# EAGLE design HP35_Z80 (EAGLE 7.6.0)

## Sheet 1 of 2
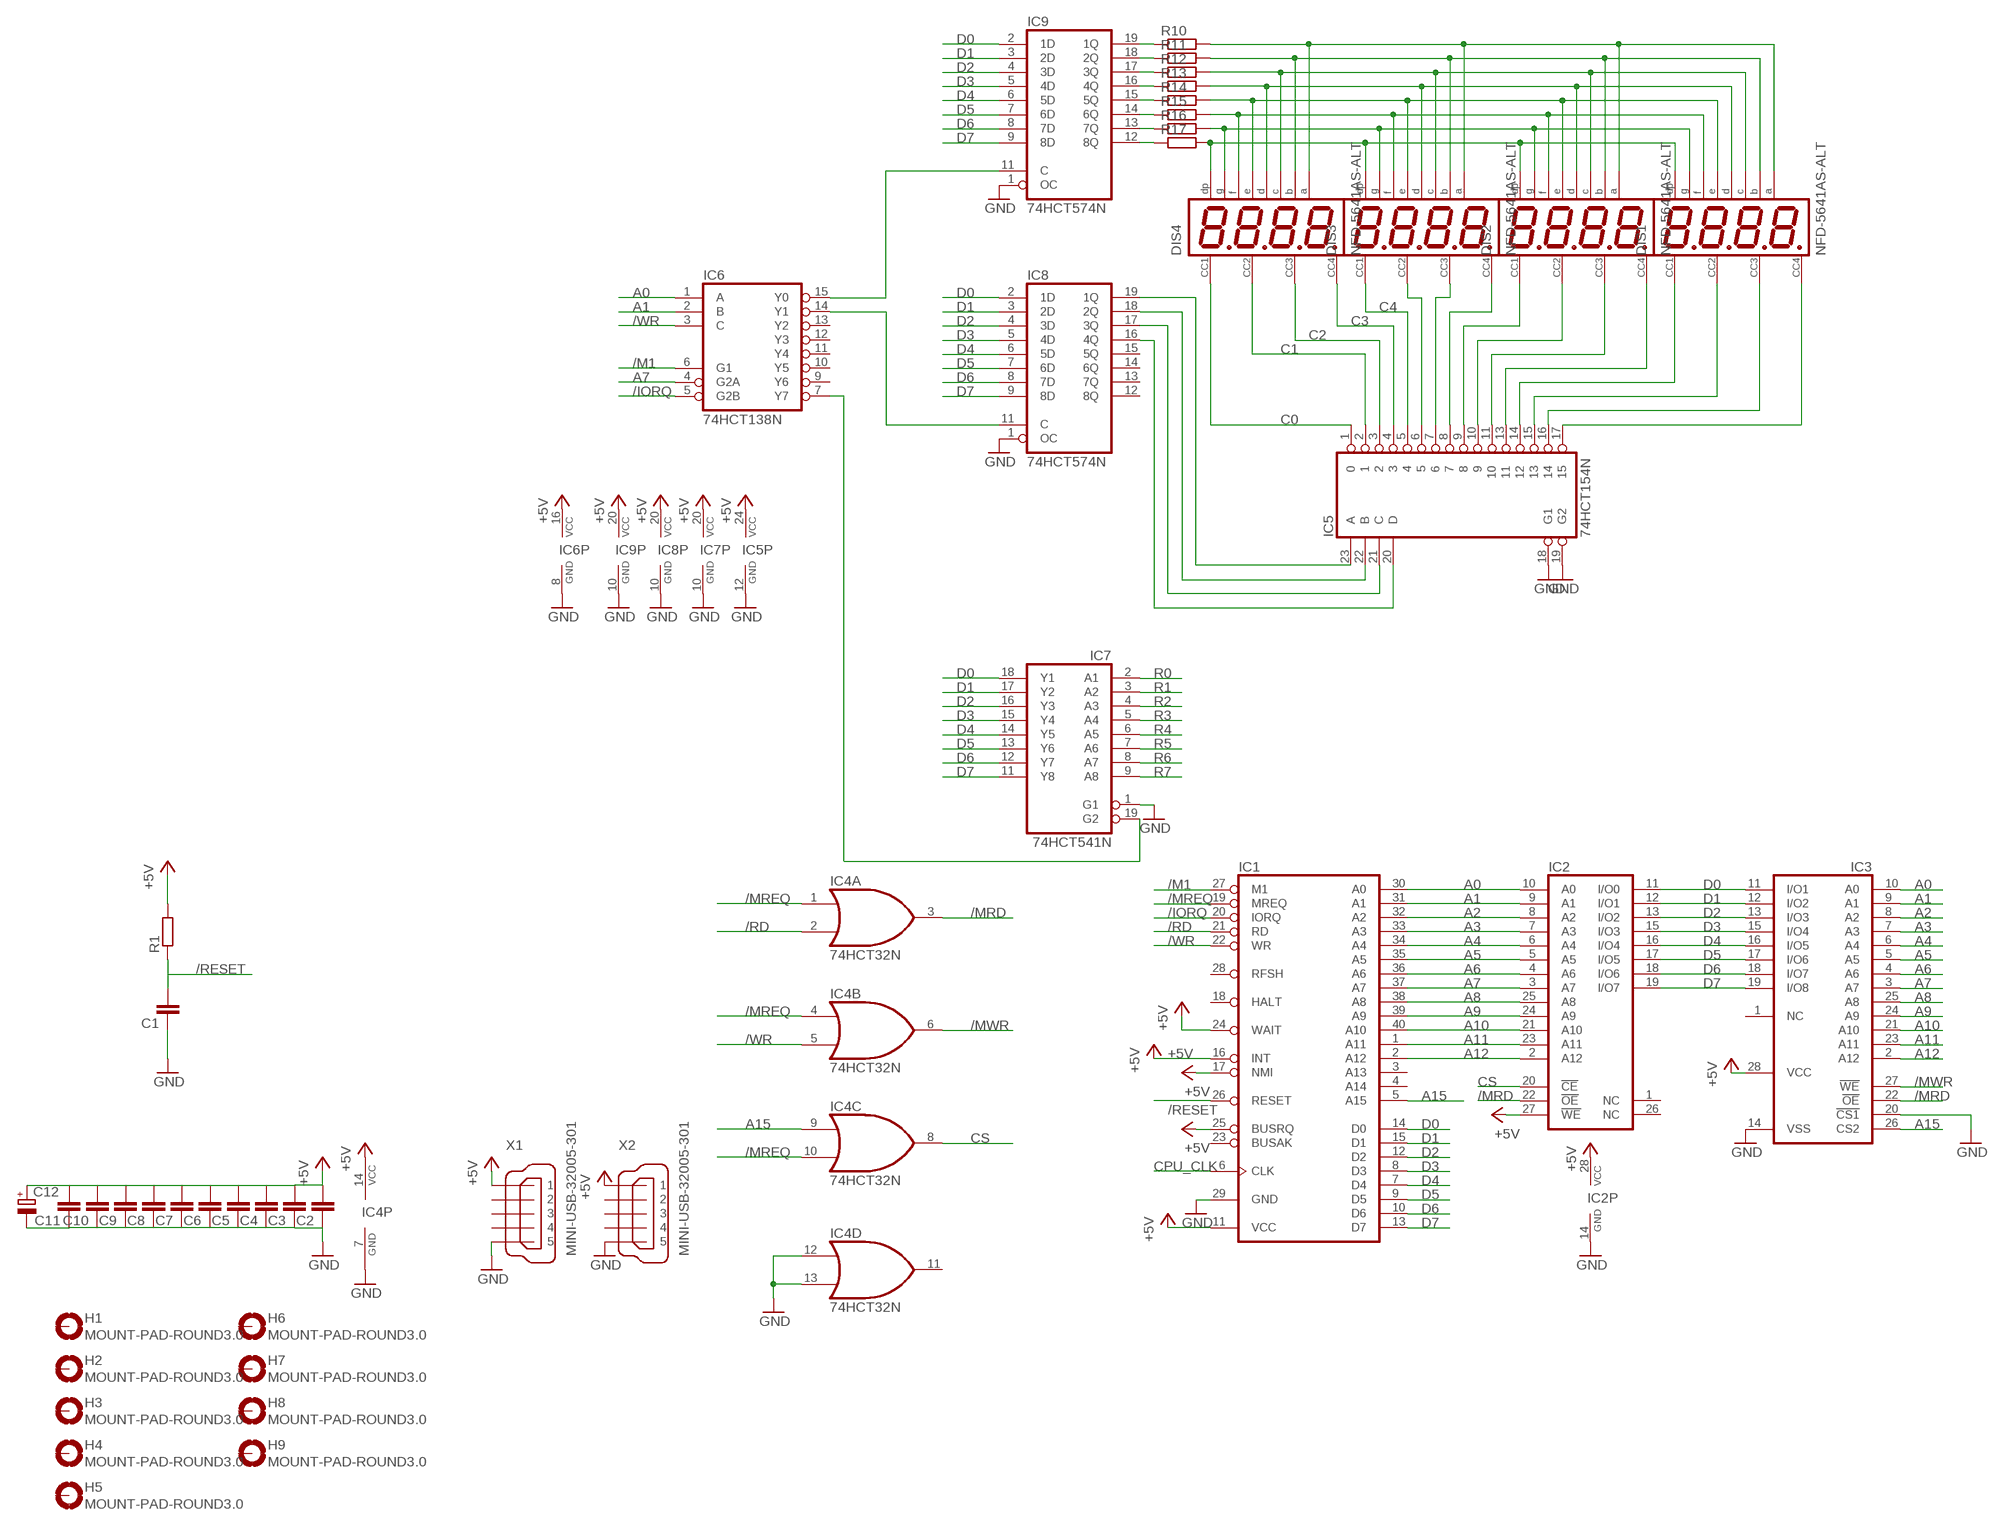
[diagram p0: schematic, sheet 1, part 1 of 2]
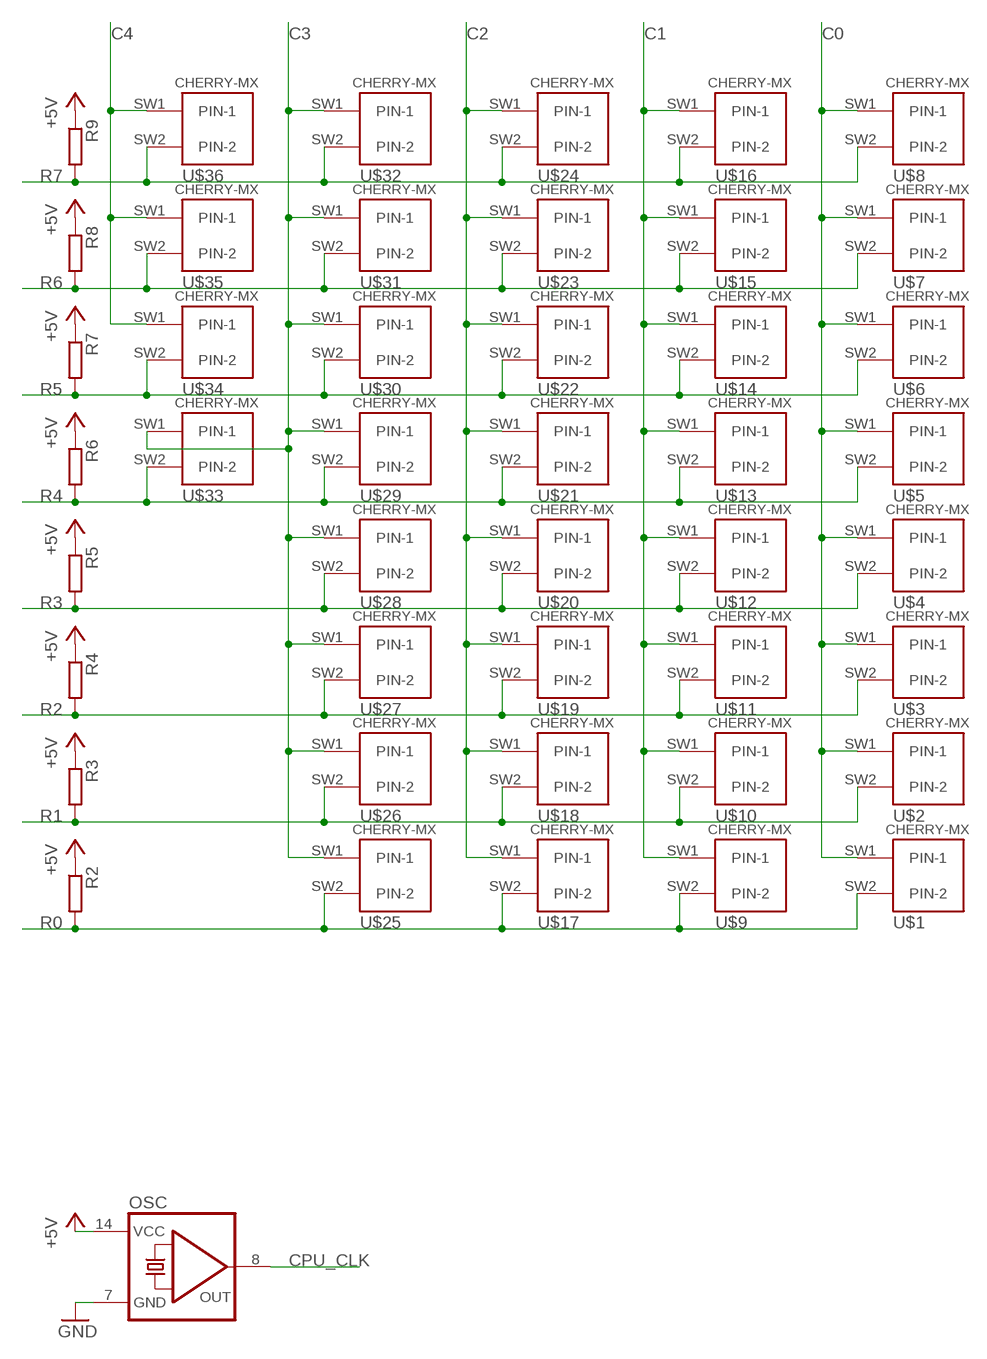
[diagram p1: schematic, sheet 1, part 2 of 2]

### Parts
C1  C-EUC1206  [C1206]
C2  C-EUC1206  [C1206]
C3  C-EUC1206  [C1206]
C4  C-EUC1206  [C1206]
C5  C-EUC1206  [C1206]
C6  C-EUC1206  [C1206]
C7  C-EUC1206  [C1206]
C8  C-EUC1206  [C1206]
C9  C-EUC1206  [C1206]
C10  C-EUC1206  [C1206]
C11  C-EUC1206  [C1206]
C12  CPOL-EUSMCD  [SMC_D]
DIS1  NFD-5641AS-ALT  [NFD-5641]
DIS2  NFD-5641AS-ALT  [NFD-5641]
DIS3  NFD-5641AS-ALT  [NFD-5641]
DIS4  NFD-5641AS-ALT  [NFD-5641]
H1  MOUNT-PAD-ROUND3.0  [3,0-PAD]
H2  MOUNT-PAD-ROUND3.0  [3,0-PAD]
H3  MOUNT-PAD-ROUND3.0  [3,0-PAD]
H4  MOUNT-PAD-ROUND3.0  [3,0-PAD]
H5  MOUNT-PAD-ROUND3.0  [3,0-PAD]
H6  MOUNT-PAD-ROUND3.0  [3,0-PAD]
H7  MOUNT-PAD-ROUND3.0  [3,0-PAD]
H8  MOUNT-PAD-ROUND3.0  [3,0-PAD]
H9  MOUNT-PAD-ROUND3.0  [3,0-PAD]
IC1  Z80CPU  [DIL40]
IC2  78C64P  [DIL28-6]
IC3  6264A  [DIL28-6]
IC4  74HCT32N  7432N  [DIL14]
IC5  74HCT154N  [DIL24-6]
IC6  74HCT138N  [DIL16]
IC7  74HCT541N  [DIL20]
IC8  74HCT574N  74HCT573N  [DIL20]
IC9  74HCT574N  74HCT573N  [DIL20]
OSC  QG5860  [DIL14S]
R1  R-EU_R1206  [R1206]
R2  R-EU_R1206  [R1206]
R3  R-EU_R1206  [R1206]
R4  R-EU_R1206  [R1206]
R5  R-EU_R1206  [R1206]
R6  R-EU_R1206  [R1206]
R7  R-EU_R1206  [R1206]
R8  R-EU_R1206  [R1206]
R9  R-EU_R1206  [R1206]
R10  R-EU_R1206  [R1206]
R11  R-EU_R1206  [R1206]
R12  R-EU_R1206  [R1206]
R13  R-EU_R1206  [R1206]
R14  R-EU_R1206  [R1206]
R15  R-EU_R1206  [R1206]
R16  R-EU_R1206  [R1206]
R17  R-EU_R1206  [R1206]
U$1  CHERRY-MX  [CHERRY-MX]
U$2  CHERRY-MX  [CHERRY-MX]
U$3  CHERRY-MX  [CHERRY-MX]
U$4  CHERRY-MX  [CHERRY-MX]
U$5  CHERRY-MX  [CHERRY-MX]
U$6  CHERRY-MX  [CHERRY-MX]
U$7  CHERRY-MX  [CHERRY-MX]
U$8  CHERRY-MX  [CHERRY-MX]
U$9  CHERRY-MX  [CHERRY-MX]
U$10  CHERRY-MX  [CHERRY-MX]
U$11  CHERRY-MX  [CHERRY-MX]
U$12  CHERRY-MX  [CHERRY-MX]
U$13  CHERRY-MX  [CHERRY-MX]
U$14  CHERRY-MX  [CHERRY-MX]
U$15  CHERRY-MX  [CHERRY-MX]
U$16  CHERRY-MX  [CHERRY-MX]
U$17  CHERRY-MX  [CHERRY-MX]
U$18  CHERRY-MX  [CHERRY-MX]
U$19  CHERRY-MX  [CHERRY-MX]
U$20  CHERRY-MX  [CHERRY-MX]
U$21  CHERRY-MX  [CHERRY-MX]
U$22  CHERRY-MX  [CHERRY-MX]
U$23  CHERRY-MX  [CHERRY-MX]
U$24  CHERRY-MX  [CHERRY-MX]
U$25  CHERRY-MX  [CHERRY-MX]
U$26  CHERRY-MX  [CHERRY-MX]
U$27  CHERRY-MX  [CHERRY-MX]
U$28  CHERRY-MX  [CHERRY-MX]
U$29  CHERRY-MX  [CHERRY-MX]
U$30  CHERRY-MX  [CHERRY-MX]
U$31  CHERRY-MX  [CHERRY-MX]
U$32  CHERRY-MX  [CHERRY-MX]
U$33  CHERRY-MX  [CHERRY-MX]
U$34  CHERRY-MX  [CHERRY-MX]
U$35  CHERRY-MX  [CHERRY-MX]
U$36  CHERRY-MX  [CHERRY-MX]
X1  MINI-USB-32005-301  [32005-301]
X2  MINI-USB-32005-301  [32005-301]

### Nets
+5V: C2.2 C3.2 C4.2 C5.2 C6.2 C7.2 C8.2 C9.2 C10.2 C11.2 C12.+ IC1.11(VCC) IC1.16(INT) IC1.17(NMI) IC1.24(WAIT) IC1.25(BUSRQ) IC2.27(!WE) IC2.28(VCC) IC3.28(VCC) IC4.14(P:VCC) IC5.24(VCC) IC6.16(VCC) IC7.20(VCC) IC8.20(VCC) IC9.20(VCC) OSC.14(VCC) R1.2 R2.1 R3.1 R4.1 R5.1 R6.1 R7.1 R8.1 R9.1 X1.1 X2.1
/IORQ: IC1.20(IORQ) IC6.5(G2B)
/M1: IC1.27(M1) IC6.6(G1)
/MRD: IC2.22(!OE) IC3.22(!OE) IC4.3(A:O)
/MREQ: IC1.19(MREQ) IC4.1(A:I0) IC4.4(B:I0) IC4.10(C:I1)
/MWR: IC3.27(!WE) IC4.6(B:O)
/RD: IC1.21(RD) IC4.2(A:I1)
/RESET: C1.2 IC1.26(RESET) R1.1
/WR: IC1.22(WR) IC4.5(B:I1) IC6.3(C)
A0: IC1.30(A0) IC2.10(A0) IC3.10(A0) IC6.1(A)
A1: IC1.31(A1) IC2.9(A1) IC3.9(A1) IC6.2(B)
A2: IC1.32(A2) IC2.8(A2) IC3.8(A2)
A3: IC1.33(A3) IC2.7(A3) IC3.7(A3)
A4: IC1.34(A4) IC2.6(A4) IC3.6(A4)
A5: IC1.35(A5) IC2.5(A5) IC3.5(A5)
A6: IC1.36(A6) IC2.4(A6) IC3.4(A6)
A7: IC1.37(A7) IC2.3(A7) IC3.3(A7) IC6.4(G2A)
A8: IC1.38(A8) IC2.25(A8) IC3.25(A8)
A9: IC1.39(A9) IC2.24(A9) IC3.24(A9)
A10: IC1.40(A10) IC2.21(A10) IC3.21(A10)
A11: IC1.1(A11) IC2.23(A11) IC3.23(A11)
A12: IC1.2(A12) IC2.2(A12) IC3.2(A12)
A15: IC1.5(A15) IC3.26(CS2) IC4.9(C:I0)
C0: DIS4.P$12 IC5.1 U$1.SW1(PIN-1) U$2.SW1(PIN-1) U$3.SW1(PIN-1) U$4.SW1(PIN-1) U$5.SW1(PIN-1) U$6.SW1(PIN-1) U$7.SW1(PIN-1) U$8.SW1(PIN-1)
C1: DIS4.P$9 IC5.2 U$9.SW1(PIN-1) U$10.SW1(PIN-1) U$11.SW1(PIN-1) U$12.SW1(PIN-1) U$13.SW1(PIN-1) U$14.SW1(PIN-1) U$15.SW1(PIN-1) U$16.SW1(PIN-1)
C2: DIS4.P$8 IC5.3 U$17.SW1(PIN-1) U$18.SW1(PIN-1) U$19.SW1(PIN-1) U$20.SW1(PIN-1) U$21.SW1(PIN-1) U$22.SW1(PIN-1) U$23.SW1(PIN-1) U$24.SW1(PIN-1)
C3: DIS4.P$6 IC5.4 U$25.SW1(PIN-1) U$26.SW1(PIN-1) U$27.SW1(PIN-1) U$28.SW1(PIN-1) U$29.SW1(PIN-1) U$30.SW1(PIN-1) U$31.SW1(PIN-1) U$32.SW1(PIN-1) U$33.SW1(PIN-1)
C4: DIS3.P$12 IC5.5 U$34.SW1(PIN-1) U$35.SW1(PIN-1) U$36.SW1(PIN-1)
CPU_CLK: IC1.6(CLK) OSC.8(OUT)
CS: IC2.20(!CE) IC4.8(C:O)
D0: IC1.14(D0) IC2.11(I/O0) IC3.11(I/O1) IC7.18(Y1) IC8.2(1D) IC9.2(1D)
D1: IC1.15(D1) IC2.12(I/O1) IC3.12(I/O2) IC7.17(Y2) IC8.3(2D) IC9.3(2D)
D2: IC1.12(D2) IC2.13(I/O2) IC3.13(I/O3) IC7.16(Y3) IC8.4(3D) IC9.4(3D)
D3: IC1.8(D3) IC2.15(I/O3) IC3.15(I/O4) IC7.15(Y4) IC8.5(4D) IC9.5(4D)
D4: IC1.7(D4) IC2.16(I/O4) IC3.16(I/O5) IC7.14(Y5) IC8.6(5D) IC9.6(5D)
D5: IC1.9(D5) IC2.17(I/O5) IC3.17(I/O6) IC7.13(Y6) IC8.7(6D) IC9.7(6D)
D6: IC1.10(D6) IC2.18(I/O6) IC3.18(I/O7) IC7.12(Y7) IC8.8(7D) IC9.8(7D)
D7: IC1.13(D7) IC2.19(I/O7) IC3.19(I/O8) IC7.11(Y8) IC8.9(8D) IC9.9(8D)
GND: C1.1 C2.1 C3.1 C4.1 C5.1 C6.1 C7.1 C8.1 C9.1 C10.1 C11.1 C12.- IC1.29(GND) IC2.14(GND) IC3.14(VSS) IC3.20(!CS1) IC4.7(P:GND) IC4.12(D:I0) IC4.13(D:I1) IC5.12(GND) IC5.18(G1) IC5.19(G2) IC6.8(GND) IC7.1(G1) IC7.10(GND) IC8.1(OC) IC8.10(GND) IC9.1(OC) IC9.10(GND) OSC.7(GND) X1.5 X2.5
N$1: IC6.15(Y0) IC9.11(C)
N$2: IC5.20(D) IC8.16(4Q)
N$3: IC6.14(Y1) IC8.11(C)
N$4: IC5.21(C) IC8.17(3Q)
N$5: IC5.22(B) IC8.18(2Q)
N$6: IC5.23(A) IC8.19(1Q)
N$8: IC6.7(Y7) IC7.19(G2)
N$9: IC9.12(8Q) R17.1
N$10: IC9.13(7Q) R16.1
N$11: IC9.14(6Q) R15.1
N$12: IC9.15(5Q) R14.1
N$13: DIS3.P$9 IC5.6
N$14: DIS3.P$8 IC5.7
N$15: DIS3.P$6 IC5.8
N$16: DIS2.P$12 IC5.9
N$17: DIS2.P$9 IC5.10
N$18: DIS2.P$8 IC5.11
N$19: DIS2.P$6 IC5.13
N$20: DIS1.P$12 IC5.14
N$21: DIS1.P$9 IC5.15
N$22: DIS1.P$8 IC5.16
N$23: DIS1.P$6 IC5.17
N$24: IC9.16(4Q) R13.1
N$25: IC9.17(3Q) R12.1
N$26: IC9.18(2Q) R11.1
N$27: IC9.19(1Q) R10.1
N$28: DIS1.P$11 DIS2.P$11 DIS3.P$11 DIS4.P$11 R10.2
N$31: DIS1.P$3 DIS2.P$3 DIS3.P$3 DIS4.P$3 R17.2
N$32: DIS1.P$5 DIS2.P$5 DIS3.P$5 DIS4.P$5 R16.2
N$33: DIS1.P$10 DIS2.P$10 DIS3.P$10 DIS4.P$10 R15.2
N$34: DIS1.P$1 DIS2.P$1 DIS3.P$1 DIS4.P$1 R14.2
N$36: DIS1.P$7 DIS2.P$7 DIS3.P$7 DIS4.P$7 R11.2
N$37: DIS1.P$4 DIS2.P$4 DIS3.P$4 DIS4.P$4 R12.2
N$38: DIS1.P$2 DIS2.P$2 DIS3.P$2 DIS4.P$2 R13.2
R0: IC7.2(A1) R2.2 U$1.SW2(PIN-2) U$9.SW2(PIN-2) U$17.SW2(PIN-2) U$25.SW2(PIN-2)
R1: IC7.3(A2) R3.2 U$2.SW2(PIN-2) U$10.SW2(PIN-2) U$18.SW2(PIN-2) U$26.SW2(PIN-2)
R2: IC7.4(A3) R4.2 U$3.SW2(PIN-2) U$11.SW2(PIN-2) U$19.SW2(PIN-2) U$27.SW2(PIN-2)
R3: IC7.5(A4) R5.2 U$4.SW2(PIN-2) U$12.SW2(PIN-2) U$20.SW2(PIN-2) U$28.SW2(PIN-2)
R4: IC7.6(A5) R6.2 U$5.SW2(PIN-2) U$13.SW2(PIN-2) U$21.SW2(PIN-2) U$29.SW2(PIN-2) U$33.SW2(PIN-2)
R5: IC7.7(A6) R7.2 U$6.SW2(PIN-2) U$14.SW2(PIN-2) U$22.SW2(PIN-2) U$30.SW2(PIN-2) U$34.SW2(PIN-2)
R6: IC7.8(A7) R8.2 U$7.SW2(PIN-2) U$15.SW2(PIN-2) U$23.SW2(PIN-2) U$31.SW2(PIN-2) U$35.SW2(PIN-2)
R7: IC7.9(A8) R9.2 U$8.SW2(PIN-2) U$16.SW2(PIN-2) U$24.SW2(PIN-2) U$32.SW2(PIN-2) U$36.SW2(PIN-2)
Unconnected: H1.B3,0(MOUNT) H2.B3,0(MOUNT) H3.B3,0(MOUNT) H4.B3,0(MOUNT) H5.B3,0(MOUNT) H6.B3,0(MOUNT) H7.B3,0(MOUNT) H8.B3,0(MOUNT) H9.B3,0(MOUNT) IC1.3(A13) IC1.4(A14) IC1.18(HALT) IC1.23(BUSAK) IC1.28(RFSH) IC2.1(NC) IC2.26(NC) IC3.1(NC) IC4.11(D:O) IC6.9(Y6) IC6.10(Y5) IC6.11(Y4) IC6.12(Y3) IC6.13(Y2) IC8.12(8Q) IC8.13(7Q) IC8.14(6Q) IC8.15(5Q) X1.2 X1.3 X1.4 X2.2 X2.3 X2.4

## Sheet 2 of 2

## Library data of the parts
C1-C11 = rcl:C-EU: CAPACITOR, European symbol
C12 = rcl:CPOL-EU: POLARIZED CAPACITOR, European symbol
DIS1-DIS4 = display-nfd:NFD-5641AS-ALT: Four Digit 0.56" CC Seven-Segment LED Display Futurlec part number: 7FR5641AS Created by RobG
H1-H9 = holes:MOUNT-PAD-ROUND: MOUNTING PAD, round
IC1 = zilog:Z80CPU: Z80 FAMILY DEVICE
IC2 = memory-idt:78C64P: MEMORY; OC_FARNELL: unknown; OC_NEWARK: unknown
IC3 = memory-hitachi:6264A: MEMORY; OC_FARNELL: 283605; OC_NEWARK: unknown
IC4 = 74xx-us:74*32: Quad 2-input OR gate
IC5 = 74xx-eu:74*154: 4-line to 16-line data SELECTOR/MULTIPLEXER
IC6 = 74xx-eu:74*138: 3-line to 8-line DECODER/DEMULTIPLEXER
IC7 = 74xx-eu:74*541: Octal BUFFER and LINE DRIVER, 3-state
IC8 IC9 = 74xx-eu:74*573: 8-bit D latch BUS DRIVER
OSC = crystal:QG5860: CRYSTAL RESONATOR; OC_FARNELL: unknown; OC_NEWARK: unknown
R1-R17 = rcl:R-EU_: RESISTOR, European symbol
U$1-U$36 = cherry:CHERRY-MX: Cherry MX series keyswitch
X1 X2 = con-cypressindustries:MINI-USB-: MINI USB-B Conector Source: www.cypressindustries.com; OC_FARNELL: unknown; OC_NEWARK: unknown

## Board
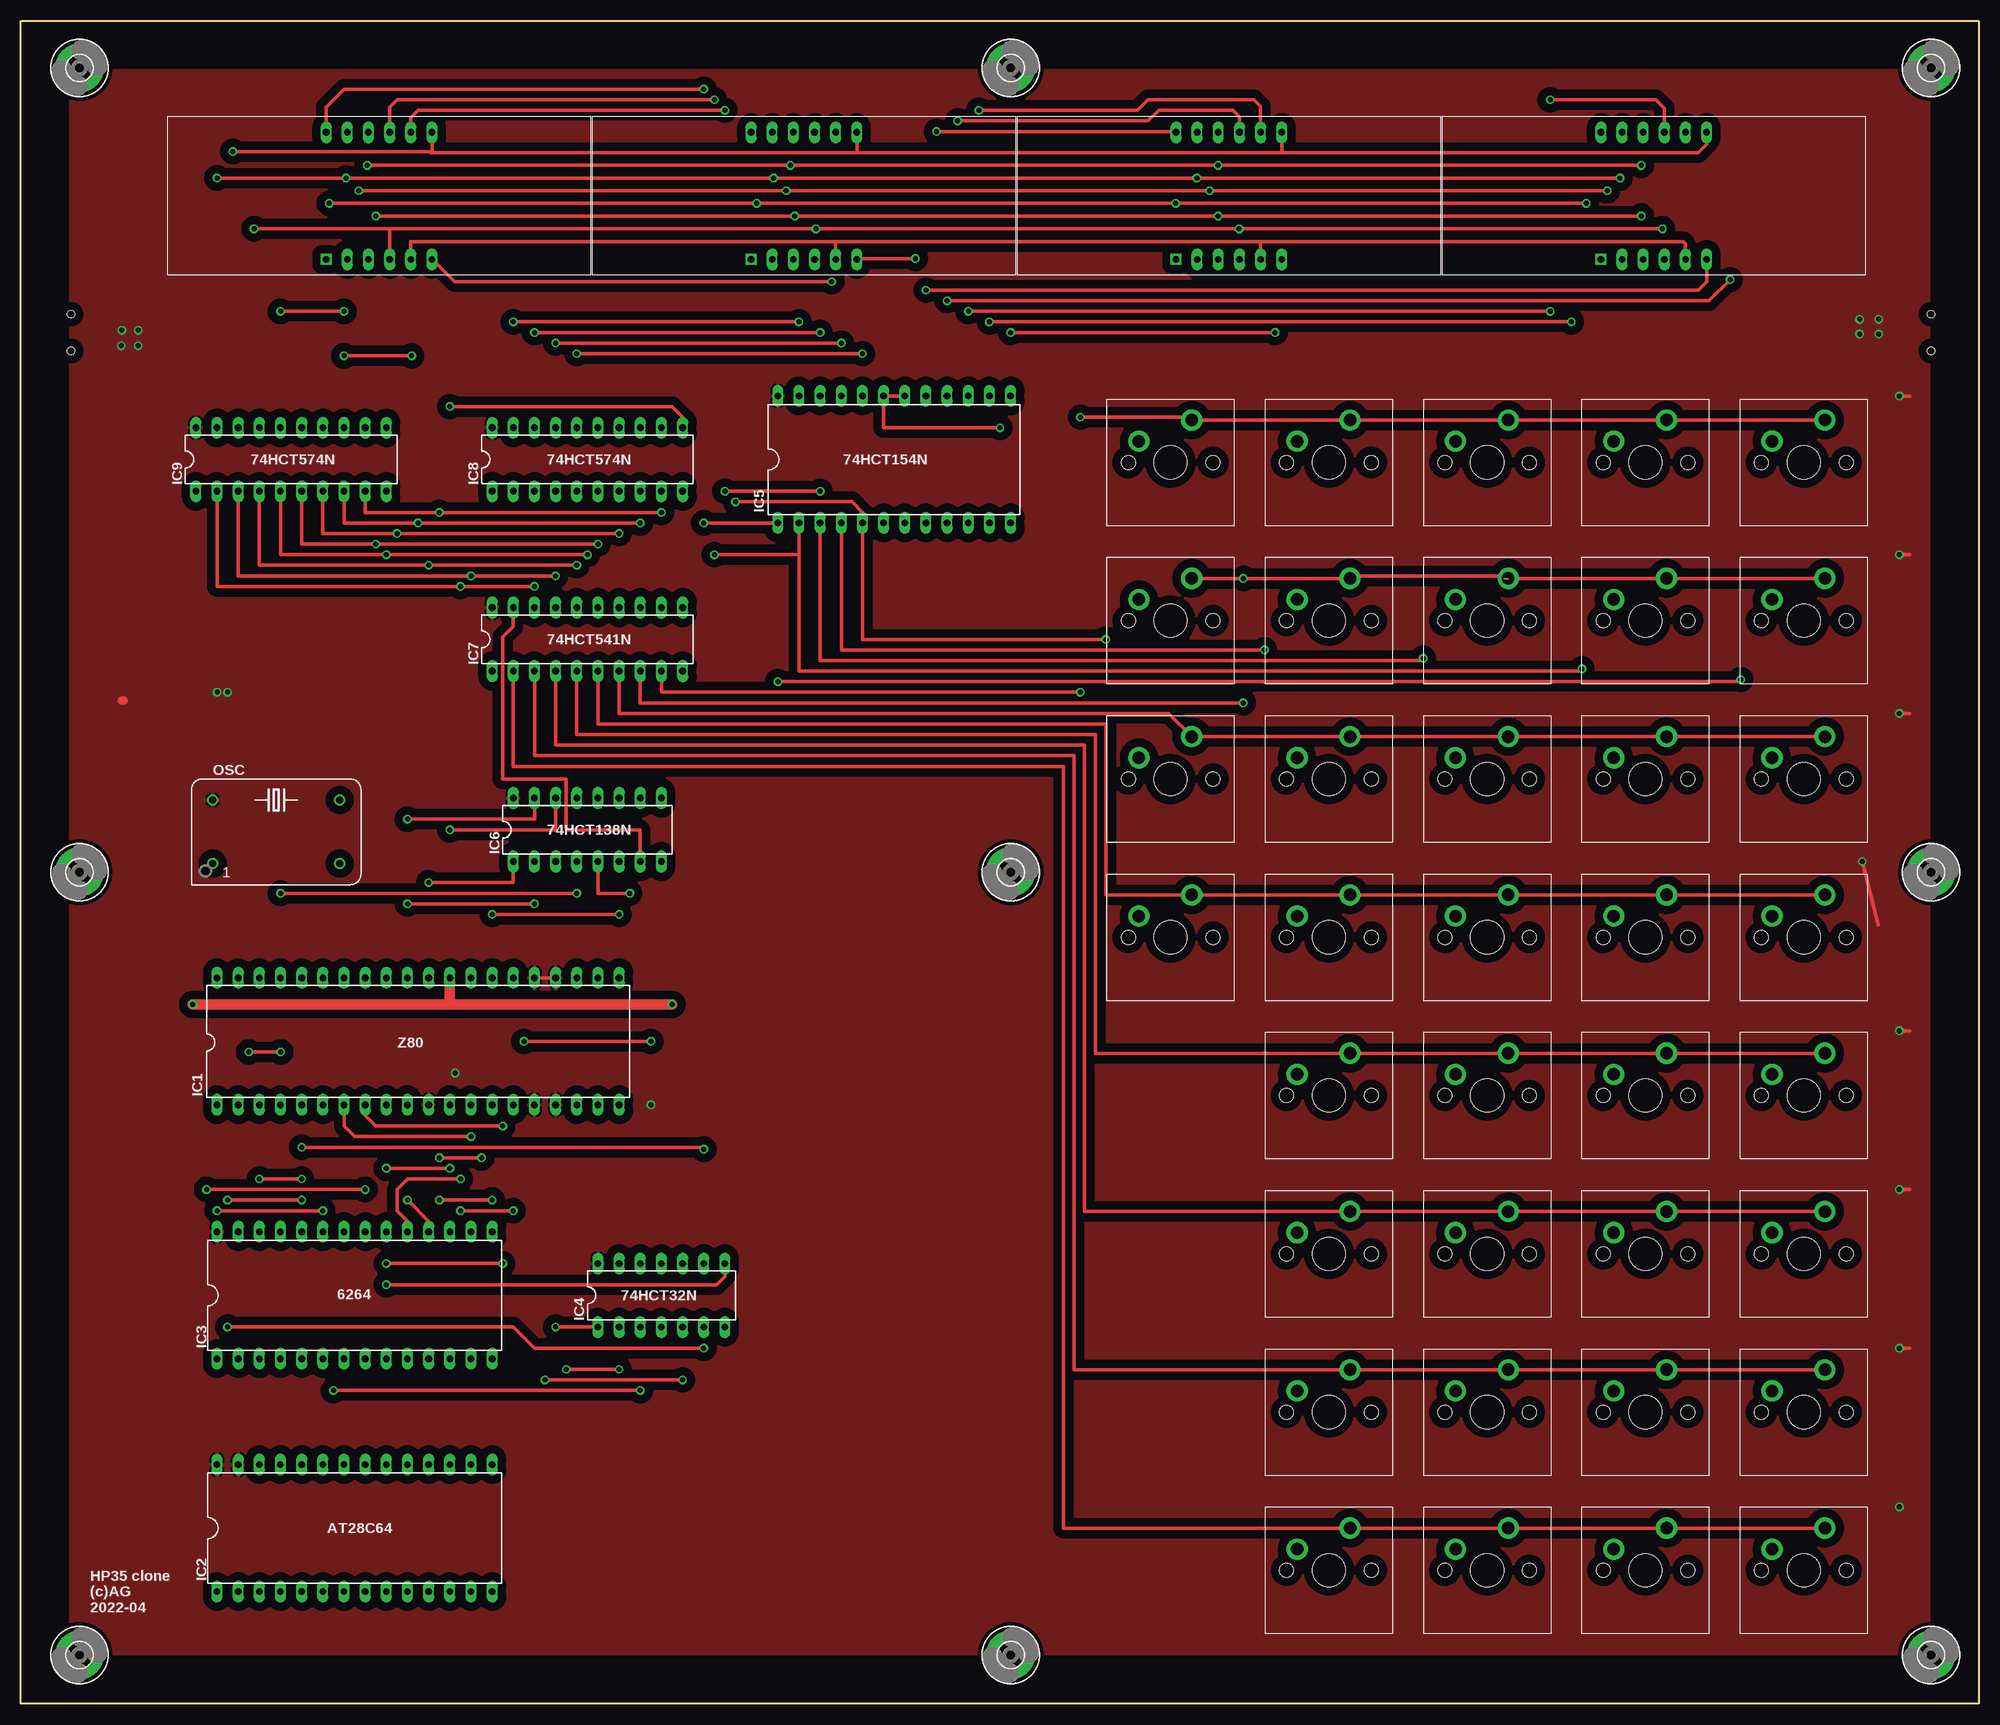
[diagram p2: board, top side]
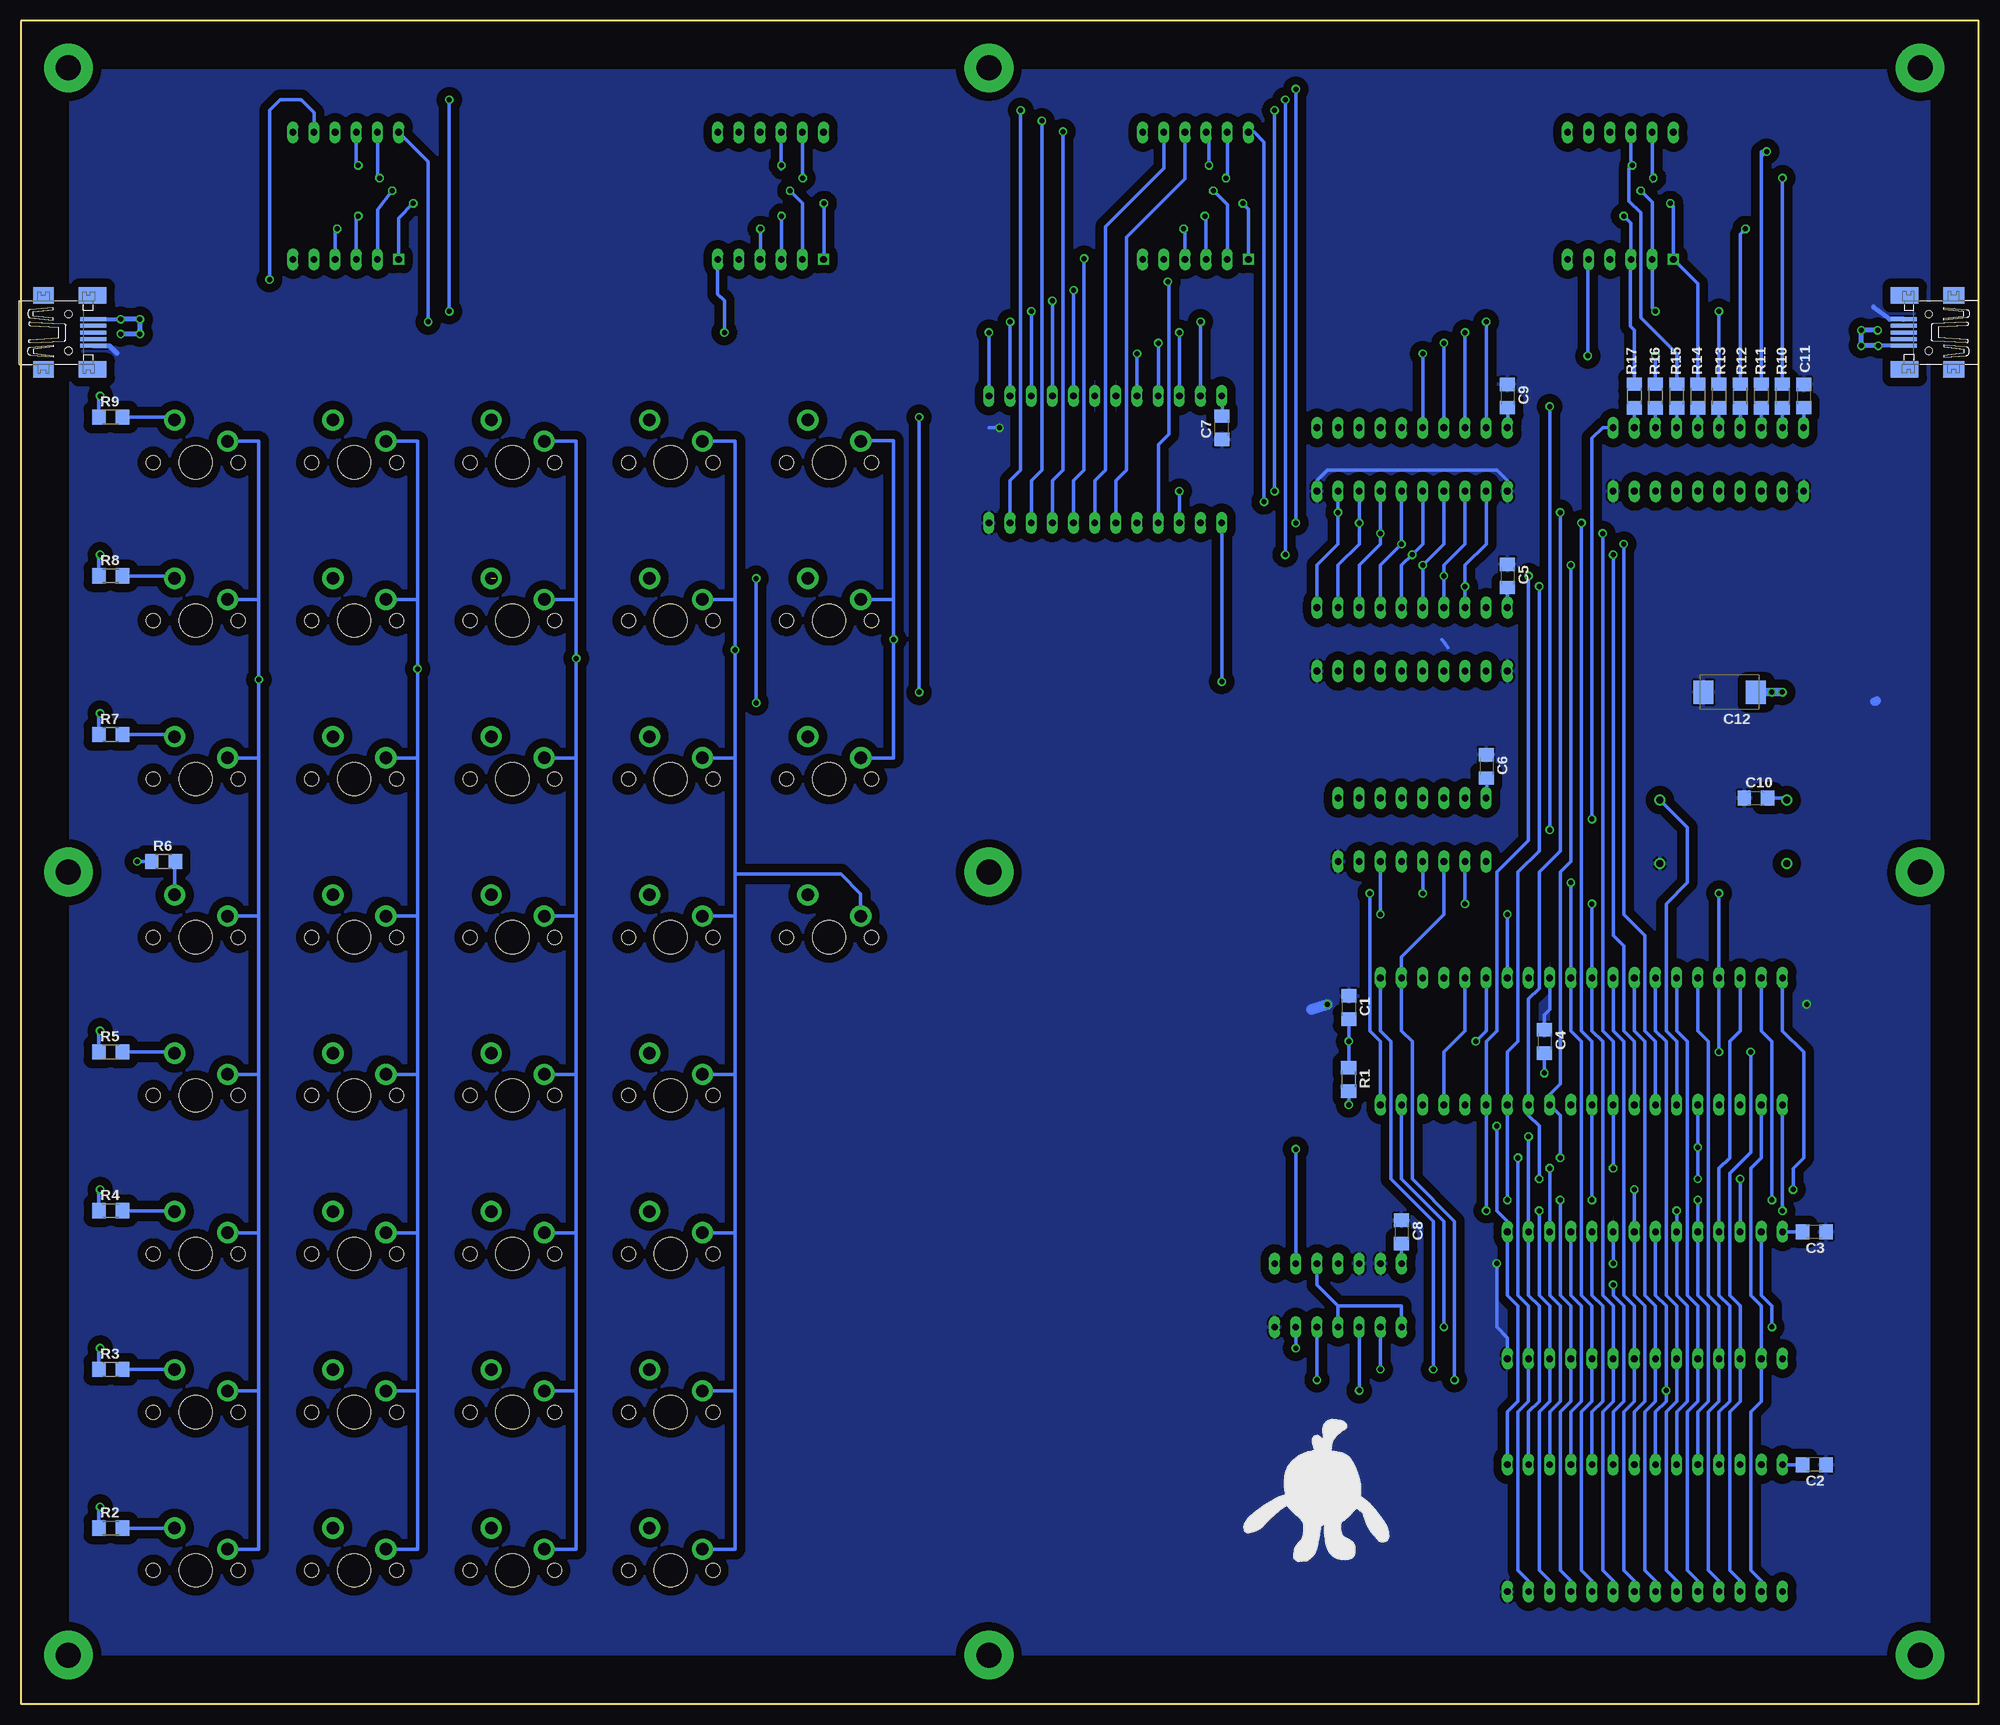
[diagram p3: board, bottom side, seen from below]

Size 235 x 202 mm. Coordinates in mm from the lower left corner, seen from the top.
Outline: 0,0 0,202 235,202 235,0 0,0
Copper layers (1*16): Top 0.035mm / dielectric 1.5mm / Bottom 0.035mm
Design rules "default *": minimum track width 10mil, minimum drill 10mil, track to track 8mil, track to pad 8mil, pad to pad 8mil, via to via 8mil, smd to smd 8mil, copper to edge 40mil, drill to drill 8mil, minimum pad ring 10mil, minimum via ring 8mil, stop-mask expansion 4mil, vias tented up to drill 50mil, thermal gap 10mil

### Footprints (pad centres in the part's own frame; a part is rotated, then mirrored left to right if it is on the bottom)
C1206 = smd 1.6 x 1.8: 1 -1.4,0; 2 1.4,0
SMC_D = smd 2.4 x 2.8: + -3.15,0; - 3.15,0
NFD-5641 = drill 0.8 square: P$1 -6.35,-7.62 | drill 0.8 long: P$2 -3.81,-7.62; P$3 -1.27,-7.62; P$4 1.27,-7.62; P$5 3.81,-7.62; P$6 6.35,-7.62; P$7 6.35,7.62; P$8 3.81,7.62; P$9 1.27,7.62; P$10 -1.27,7.62; P$11 -3.81,7.62; P$12 -6.35,7.62
3,0-PAD = drill 3 pad 5.842: B3,0 0,0
DIL40 = drill 0.813 long: 1 -24.13,-7.62; 2 -21.59,-7.62; 3 -19.05,-7.62; 4 -16.51,-7.62; 5 -13.97,-7.62; 6 -11.43,-7.62; 7 -8.89,-7.62; 8 -6.35,-7.62; 9 -3.81,-7.62; 10 -1.27,-7.62; 11 1.27,-7.62; 12 3.81,-7.62; 13 6.35,-7.62; 14 8.89,-7.62; 15 11.43,-7.62; 16 13.97,-7.62; 17 16.51,-7.62; 18 19.05,-7.62; 19 21.59,-7.62; 20 24.13,-7.62; 21 24.13,7.62; 22 21.59,7.62; 23 19.05,7.62; 24 16.51,7.62; 25 13.97,7.62; 26 11.43,7.62; 27 8.89,7.62; 28 6.35,7.62; 29 3.81,7.62; 30 1.27,7.62; 31 -1.27,7.62; 32 -3.81,7.62; 33 -6.35,7.62; 34 -8.89,7.62; 35 -11.43,7.62; 36 -13.97,7.62; 37 -16.51,7.62; 38 -19.05,7.62; 39 -21.59,7.62; 40 -24.13,7.62
DIL28-6 = drill 0.813 long: 1 -16.51,-7.62; 2 -13.97,-7.62; 3 -11.43,-7.62; 4 -8.89,-7.62; 5 -6.35,-7.62; 6 -3.81,-7.62; 7 -1.27,-7.62; 8 1.27,-7.62; 9 3.81,-7.62; 10 6.35,-7.62; 11 8.89,-7.62; 12 11.43,-7.62; 13 13.97,-7.62; 14 16.51,-7.62; 15 16.51,7.62; 16 13.97,7.62; 17 11.43,7.62; 18 8.89,7.62; 19 6.35,7.62; 20 3.81,7.62; 21 1.27,7.62; 22 -1.27,7.62; 23 -3.81,7.62; 24 -6.35,7.62; 25 -8.89,7.62; 26 -11.43,7.62; 27 -13.97,7.62; 28 -16.51,7.62
DIL14 = drill 0.813 long: 1 -7.62,-3.81; 2 -5.08,-3.81; 3 -2.54,-3.81; 4 0,-3.81; 5 2.54,-3.81; 6 5.08,-3.81; 7 7.62,-3.81; 8 7.62,3.81; 9 5.08,3.81; 10 2.54,3.81; 11 0,3.81; 12 -2.54,3.81; 13 -5.08,3.81; 14 -7.62,3.81
DIL24-6 = drill 0.813 long: 1 -13.97,-7.62; 2 -11.43,-7.62; 3 -8.89,-7.62; 4 -6.35,-7.62; 5 -3.81,-7.62; 6 -1.27,-7.62; 7 1.27,-7.62; 8 3.81,-7.62; 9 6.35,-7.62; 10 8.89,-7.62; 11 11.43,-7.62; 12 13.97,-7.62; 13 13.97,7.62; 14 11.43,7.62; 15 8.89,7.62; 16 6.35,7.62; 17 3.81,7.62; 18 1.27,7.62; 19 -1.27,7.62; 20 -3.81,7.62; 21 -6.35,7.62; 22 -8.89,7.62; 23 -11.43,7.62; 24 -13.97,7.62
DIL16 = drill 0.813 long: 1 -8.89,-3.81; 2 -6.35,-3.81; 3 -3.81,-3.81; 4 -1.27,-3.81; 5 1.27,-3.81; 6 3.81,-3.81; 7 6.35,-3.81; 8 8.89,-3.81; 9 8.89,3.81; 10 6.35,3.81; 11 3.81,3.81; 12 1.27,3.81; 13 -1.27,3.81; 14 -3.81,3.81; 15 -6.35,3.81; 16 -8.89,3.81
DIL20 = drill 0.813 long: 1 -11.43,-3.81; 2 -8.89,-3.81; 3 -6.35,-3.81; 4 -3.81,-3.81; 5 -1.27,-3.81; 6 1.27,-3.81; 7 3.81,-3.81; 8 6.35,-3.81; 9 8.89,-3.81; 10 11.43,-3.81; 11 11.43,3.81; 12 8.89,3.81; 13 6.35,3.81; 14 3.81,3.81; 15 1.27,3.81; 16 -1.27,3.81; 17 -3.81,3.81; 18 -6.35,3.81; 19 -8.89,3.81; 20 -11.43,3.81
DIL14S = drill 0.813: 1 -7.62,-3.81; 7 7.62,-3.81; 8 7.62,3.81; 14 -7.62,3.81
R1206 = smd 1.6 x 1.803: 1 -1.422,0; 2 1.422,0
CHERRY-MX = drill 1.5 pad 2.54: SW1 -3.81,2.54; SW2 2.54,5.08 | hole 4: 0,0 | hole 1.7: -5.08,0; 5.08,0
32005-301 = smd 3.1 x 0.5: 1 3,1.6; 2 3,0.8; 3 3,0; 4 3,-0.8; 5 3,-1.6 | smd 2.5 x 2: M1 -3,-4.45; M2 -3,4.45 | smd 3.3 x 2: M3 2.9,4.45; M4 2.9,-4.45 | hole 0.9: 0,2.2; 0,-2.2

### Placement (x,y rotation side)
C1  75.62,83.56 270 bottom
C2  19.74,28.7 180 bottom
C3  19.74,56.64 180 bottom
C4  52.12,79.5 270 bottom
C5  56.57,135.38 270 bottom
C6  59.11,112.52 270 bottom
C7  90.86,153.16 90 bottom
C8  69.27,56.64 270 bottom
C9  56.57,156.97 270 bottom
C10  26.73,108.71 0 bottom
C11  21.01,156.97 270 bottom
C12  29.9,121.41 180 bottom
DIS1  196,181 0 top
DIS2  145,181 0 top
DIS3  94,181 0 top
DIS4  43,181 0 top
H1  118.8,99.82 0 top
H2  7.04,5.84 0 top
H3  7.04,99.82 0 top
H4  7.04,196.34 0 top
H5  118.8,196.34 0 top
H6  229.29,196.34 0 top
H7  229.29,99.82 0 top
H8  229.29,5.84 0 top
H9  118.8,5.84 0 top
IC1  47.68,79.5 0 top
IC2  40.06,21.08 0 top
IC3  40.06,49.02 0 top
IC4  76.89,49.02 0 top
IC5  104.83,149.35 0 top
IC6  68,104.9 0 top
IC7  68,127.76 0 top
IC8  68,149.35 0 top
IC9  32.44,149.35 0 top
OSC  30.66,104.65 0 top
R1  75.62,74.93 270 bottom
R2  224.21,21.08 0 bottom
R3  224.21,40.13 0 bottom
R4  224.21,59.18 0 bottom
R5  224.21,78.23 0 bottom
R6  217.86,101.09 0 bottom
R7  224.21,116.33 0 bottom
R8  224.21,135.38 0 bottom
R9  224.21,154.43 0 bottom
R10  23.55,156.97 90 bottom
R11  26.09,156.97 90 bottom
R12  28.63,156.97 90 bottom
R13  31.17,156.97 90 bottom
R14  33.71,156.97 90 bottom
R15  36.25,156.97 90 bottom
R16  38.79,156.97 90 bottom
R17  41.33,156.97 90 bottom
U$1  214,16 0 top
U$2  214,35 0 top
U$3  214,54 0 top
U$4  214,73 0 top
U$5  214,92 0 top
U$6  214,111 0 top
U$7  214,130 0 top
U$8  214,149 0 top
U$9  195,16 0 top
U$10  195,35 0 top
U$11  195,54 0 top
U$12  195,73 0 top
U$13  195,92 0 top
U$14  195,111 0 top
U$15  195,130 0 top
U$16  195,149 0 top
U$17  176,16 0 top
U$18  176,35 0 top
U$19  176,54 0 top
U$20  176,73 0 top
U$21  176,92 0 top
U$22  176,111 0 top
U$23  176,130 0 top
U$24  176,149 0 top
U$25  157,16 0 top
U$26  157,35 0 top
U$27  157,54 0 top
U$28  157,73 0 top
U$29  157,92 0 top
U$30  157,111 0 top
U$31  157,130 0 top
U$32  157,149 0 top
U$33  138,92 0 top
U$34  138,111 0 top
U$35  138,130 0 top
U$36  138,149 0 top
X1  6,164.59 180 bottom
X2  229.29,164.59 0 bottom

### Tracks (layer width: path | path; a pad name or v marks a point on that pad's centre or on a via)
+5V  (via drill 0.6)
  Top 0.406: IC1.25 IC1.24 | v225.48,42.67 226.75,42.67 | v225.48,61.72 226.75,61.72 | v225.48,80.77 226.75,80.77 | v221.03,101.09 222.94,93.47 | v225.48,118.87 226.75,118.87 | v225.48,137.92 226.75,137.92 | v225.48,156.97 226.75,156.97
  Top 1.016: 12.12,120.39 12.37,120.39
  Bottom 0.406: IC1.25 61.65,80.77 64.19,78.23 IC1.17 | C2.2 IC2.28 | C3.2 IC3.28 | C4.2 v52.12,75.69 | C8.2 IC4.14 | C11.2 IC9.20 | C5.2 IC7.20 | C7.2 90.73,157.1 IC5.24 | C10.2 23.3,108.71 OSC.14 | IC6.16 58.98,108.71 C6.2 | C9.2 56.44,153.29 IC8.20 | R1.2 v75.62,71.88 | R2.1 225.63,23.47 v225.48,23.62 | R3.1 225.63,42.52 v225.48,42.67 | R4.1 225.63,61.57 v225.48,61.72 | R5.1 225.63,80.62 v225.48,80.77 | 219.28,101.24 R6.1 v221.03,101.09 | R7.1 225.63,118.72 v225.48,118.87 | R8.1 225.63,137.77 v225.48,137.92 | R9.1 225.63,156.82 v225.48,156.97 | v223,166.19 v223,166.18 | v12.06,162.99 v12.06,163
  Bottom 0.508: X2.1 v223,166.19 | X1.1 v12.06,162.99
  Bottom 0.61: v223,166.18 v220.72,166.18 v220.72,164.4 v223,164.4 | v12.12,164.84 v14.09,164.84 v14.09,163 v12.06,163
  Bottom 1.016: C12.+ v24.82,121.41 v23.55,121.41
  pour Top (isolate 1.016): 6,196 229,196 229,6 6,6
/IORQ  (via drill 0.6)
  Top 0.406: v73.08,97.28 69.27,97.28 IC6.5
  Bottom 0.406: IC1.20 71.81,79.5 73.08,80.77 v73.08,97.28
/M1  (via drill 0.6)
  Top 0.406: v56.57,94.74 v71.81,94.74
  Bottom 0.406: IC1.27 v56.57,94.74 | v71.81,94.74 IC6.6
/MRD  (via drill 0.6)
  Top 0.406: v74.35,37.59 v37.52,37.59
  Bottom 0.406: IC2.22 38.79,35.05 37.52,36.32 v37.52,37.59 37.52,38.86 37.52,47.75 38.79,49.02 IC3.22 | IC4.3 v74.35,37.59
/MREQ  (via drill 0.6)
  Top 0.406: IC4.1 v64.19,45.21
  Bottom 0.406: IC1.19 69.27,62.99 64.19,57.91 v64.19,45.21 | IC4.1 69.27,47.75 76.89,47.75 | 76.89,47.75 IC4.4 | IC4.10 79.43,50.29 76.89,47.75
/MWR  (via drill 0.6)
  Top 0.406: v81.97,42.67 61.65,42.67 59.11,45.21 v24.82,45.21
  Bottom 0.406: IC4.6 v81.97,42.67 | v24.82,45.21 24.82,47.75 26.09,49.02 IC3.27
/RD  (via drill 0.6)
  Top 0.406: v65.46,40.13 v71.81,40.13
  Bottom 0.406: IC1.21 71.81,80.77 70.54,79.5 70.54,62.99 65.46,57.91 v65.46,40.13 | IC4.2 v71.81,40.13
/RESET  (via drill 0.6)
  Top 0.406: v60.38,79.5 v75.62,79.5
  Bottom 0.406: C1.2 v75.62,79.5 75.62,78.23 R1.1 | IC1.26 59.11,80.77 v60.38,79.5
/WR  (via drill 0.6)
  Top 0.406: v79.43,38.86 v62.92,38.86
  Bottom 0.406: IC6.3 64.19,94.74 69.27,89.66 IC1.22 69.27,80.77 68,79.5 68,62.99 62.92,57.91 v62.92,38.86 | IC4.5 v79.43,38.86
A0  (via drill 0.6)
  Top 0.406: v48.95,98.55 59.11,98.55 IC6.1
  Bottom 0.406: IC2.10 46.41,14.73 47.68,16 47.68,35.05 46.41,36.32 IC3.10 46.41,47.75 47.68,49.02 47.68,79.5 48.95,80.77 IC1.30 v48.95,98.55
A1  (via drill 0.6)
  Top 0.406: v46.41,96.01 v61.65,96.01
  Bottom 0.406: IC2.9 43.87,14.73 45.14,16 45.14,35.05 43.87,36.32 IC3.9 43.87,47.75 45.14,49.02 45.14,79.5 46.41,80.77 IC1.31 v46.41,96.01 | v61.65,96.01 IC6.2
A2
  Bottom 0.406: IC2.8 41.33,14.73 42.6,16 42.6,35.05 41.33,36.32 IC3.8 41.33,47.75 42.6,49.02 42.6,79.5 43.87,80.77 IC1.32
A3
  Bottom 0.406: IC2.7 38.79,14.73 40.06,16 40.06,35.05 38.79,36.32 IC3.7 38.79,47.75 40.06,49.02 40.06,79.5 41.33,80.77 IC1.33
A4
  Bottom 0.406: IC2.6 36.25,14.73 37.52,16 37.52,35.05 36.25,36.32 IC3.6 36.25,47.75 37.52,49.02 37.52,79.5 38.79,80.77 IC1.34
A5
  Bottom 0.406: IC2.5 33.71,14.73 34.98,16 34.98,35.05 33.71,36.32 IC3.5 33.71,47.75 34.98,49.02 34.98,79.5 36.25,80.77 IC1.35
A6
  Bottom 0.406: IC2.4 31.17,14.73 32.44,16 32.44,35.05 31.17,36.32 IC3.4 31.17,47.75 32.44,49.02 32.44,79.5 33.71,80.77 IC1.36
A7  (via drill 0.6)
  Top 0.406: v27.36,78.23 v31.17,78.23 | v31.17,97.28 v66.73,97.28
  Bottom 0.406: IC2.3 28.63,14.73 29.9,16 29.9,35.05 28.63,36.32 IC3.3 28.63,47.75 29.9,49.02 29.9,63.62 27.36,66.16 v27.36,78.23 | v31.17,78.23 IC1.37 v31.17,97.28 | v66.73,97.28 IC6.4
A8
  Bottom 0.406: IC2.25 31.17,35.05 29.9,36.32 29.9,47.75 31.17,49.02 IC3.25 31.17,64.26 29.9,65.53 29.9,79.5 28.63,80.77 IC1.38
A9  (via drill 0.6)
  Top 0.406: v33.71,60.45 v24.82,60.45
  Bottom 0.406: IC2.24 33.71,35.05 32.44,36.32 32.44,47.75 33.71,49.02 IC3.24 v33.71,60.45 | v24.82,60.45 24.82,79.5 26.09,80.77 IC1.39
A10  (via drill 0.6)
  Top 0.406: v41.33,61.72 v22.28,61.72
  Bottom 0.406: IC2.21 41.33,35.05 40.06,36.32 40.06,47.75 41.33,49.02 IC3.21 v41.33,61.72 | v22.28,61.72 22.28,64.26 21.01,65.53 21.01,78.23 23.55,80.77 IC1.40
A11  (via drill 0.6)
  Top 0.406: v36.25,59.18 v23.55,59.18
  Bottom 0.406: IC2.23 36.25,35.05 34.98,36.32 34.98,47.75 36.25,49.02 IC3.23 v36.25,59.18 | v23.55,59.18 IC1.1
A12
  Bottom 0.406: IC2.2 26.09,14.73 27.36,16 27.36,35.05 26.09,36.32 IC3.2 26.09,47.75 27.36,49.02 27.36,64.26 26.09,65.53 IC1.2
A15  (via drill 0.6)
  Top 0.406: v33.71,66.8 81.72,66.8 v81.97,66.55 | v28.63,62.99 v33.71,62.99
  Bottom 0.406: IC1.5 v33.71,66.8 v33.71,62.99 | v81.97,66.55 IC4.9 | IC3.26 v28.63,62.99
C0  (via drill 0.6)
  Top 0.406: v90.86,122.68 206.43,122.68 v206.43,122.93 | IC5.1 v81.97,141.73 | v81.97,193.8 38.79,193.8 36.65,191.66 DIS4.P$12
  Bottom 0.406: IC5.1 v90.86,122.68 | v81.97,141.73 v81.97,193.8 | U$8.SW1 206.43,151.54 206.43,132.54 | 206.43,132.54 v206.43,122.93 206.43,113.54 | 206.43,113.54 206.43,94.54 | 206.43,94.54 206.43,75.54 | 206.43,56.54 206.43,75.18 206.43,75.54 | 206.43,56.54 206.43,37.54 | 206.43,37.54 206.43,18.54 U$1.SW1 | U$2.SW1 206.43,37.54 | U$3.SW1 206.43,56.54 | U$5.SW1 206.43,94.54 | U$6.SW1 206.43,113.54 | U$7.SW1 206.43,132.54 | U$4.SW1 206.43,75.54
C1  (via drill 0.6)
  Top 0.406: DIS4.P$9 44.27,191.66 45.14,192.53 v83.24,192.53 | 93.4,137.92 93.4,123.95 187.38,123.95 v187.38,124.2 | 93.4,137.92 IC5.2 | v83.24,137.92 93.4,137.92
  Bottom 0.406: v83.24,192.53 v83.24,137.92 | U$16.SW1 187.38,151.54 187.38,132.54 | 187.38,132.54 v187.38,124.2 187.38,113.54 | 187.38,113.54 187.38,94.54 | 187.38,94.54 187.38,75.54 | 187.38,75.54 187.38,56.54 | 187.38,56.54 187.38,37.54 | 187.38,37.54 187.38,18.54 U$9.SW1 | U$10.SW1 187.38,37.54 | U$11.SW1 187.38,56.54 | U$12.SW1 187.38,75.54 | U$13.SW1 187.38,94.54 | U$15.SW1 187.38,132.54 | U$14.SW1 187.38,113.54
C2  (via drill 0.6)
  Top 0.406: IC5.3 95.94,125.22 168.33,125.22 v168.33,125.47 | v95.94,145.54 v84.51,145.54 | v84.51,191.26 47.68,191.26 46.81,190.39 DIS4.P$8
  Bottom 0.406: IC5.3 v95.94,145.54 | v84.51,145.54 v84.51,191.26 | U$24.SW1 168.33,151.54 168.33,132.54 | 168.33,132.54 v168.33,125.47 168.33,113.54 | 168.33,113.54 168.33,94.54 | 168.33,94.54 168.33,75.54 | 168.33,75.54 168.33,56.54 | 168.33,56.54 168.33,37.54 | 168.33,37.54 168.33,18.54 U$17.SW1 | U$18.SW1 168.33,37.54 | U$19.SW1 168.33,56.54 | U$20.SW1 168.33,75.54 | U$21.SW1 168.33,94.54 | U$22.SW1 168.33,113.54 | U$23.SW1 168.33,132.54
C3  (via drill 0.6)
  Top 0.406: IC5.4 98.48,126.49 v149.28,126.49 | v97.34,170.69 52.04,170.69 DIS4.P$6
  Bottom 0.406: IC5.4 98.48,151.13 97.21,152.4 97.21,170.56 v97.34,170.69 | U$32.SW1 149.28,151.54 149.28,132.54 | 149.28,132.54 v149.28,126.49 149.28,113.54 | 149.28,113.54 149.28,99.57 | 149.28,99.57 149.28,94.54 | 149.28,94.54 149.28,75.54 | 149.28,75.54 149.28,56.54 | 149.28,56.54 149.28,37.54 | 149.28,37.54 149.28,18.54 U$25.SW1 | U$26.SW1 149.28,37.54 | U$27.SW1 149.28,56.54 | U$28.SW1 149.28,75.54 | U$31.SW1 149.28,132.54 | U$30.SW1 149.28,113.54 | U$29.SW1 149.28,94.54 | U$33.SW1 134.19,97.18 136.58,99.57 149.28,99.57
C4  (via drill 0.6)
  Top 0.406: v85.78,144.27 99.75,144.27 101.02,143 IC5.5 101.02,127.76 v130.23,127.76
  Bottom 0.406: DIS3.P$12 86.95,188.62 85.78,187.45 v85.78,144.27 | U$34.SW1 130.23,113.54 v130.23,127.76 130.23,132.54 | 130.23,132.54 130.23,151.64 134.19,151.64 U$36.SW1 | U$35.SW1 130.23,132.54
CPU_CLK
  Bottom 0.406: IC1.6 36.25,79.5 37.52,80.77 37.52,96.01 34.98,98.55 34.98,105.15 OSC.8
CS  (via drill 0.6)
  Top 0.406: IC4.8 84.51,51.31 83.49,50.29 v43.87,50.29
  Bottom 0.406: v43.87,50.29 43.87,49.02 42.6,47.75 42.6,36.32 43.87,35.05 IC2.20
D0  (via drill 0.6)
  Top 0.406: v50.22,60.45 v56.57,60.45 | IC9.2 23.55,134.11 v52.76,134.11 v61.65,134.11
  Bottom 0.406: IC2.11 48.95,14.73 50.22,16 50.22,35.05 48.95,36.32 IC3.11 48.95,47.75 50.22,49.02 v50.22,60.45 | v56.57,60.45 IC1.14 56.57,78.23 55.3,79.5 55.3,99.82 52.76,102.36 v52.76,134.11 | IC8.2 59.11,139.19 61.65,136.65 v61.65,134.11 IC7.18
D1  (via drill 0.6)
  Top 0.406: v52.76,59.18 v59.11,59.18 | IC9.3 26.09,135.38 v54.03,135.38 v64.19,135.38
  Bottom 0.406: IC2.12 51.49,14.73 52.76,16 52.76,35.05 51.49,36.32 IC3.12 51.49,47.75 52.76,49.02 v52.76,59.18 | v59.11,59.18 IC1.15 59.11,79.5 57.84,80.77 57.84,99.82 54.03,103.63 v54.03,135.38 | IC8.3 61.65,139.19 64.19,136.65 v64.19,135.38 IC7.17
D2  (via drill 0.6)
  Top 0.406: v50.22,65.53 v55.3,65.53 | IC9.4 28.63,136.65 v48.95,136.65 v66.73,136.65
  Bottom 0.406: IC2.13 54.03,14.73 55.3,16 55.3,35.05 54.03,36.32 IC3.13 54.03,47.75 55.3,49.02 v55.3,65.53 | v50.22,65.53 50.22,70.61 IC1.12 51.49,73.15 50.22,74.42 50.22,99.82 48.95,101.09 v48.95,136.65 | IC8.4 64.19,139.19 v66.73,136.65 IC7.16
D3  (via drill 0.6)
  Top 0.406: v57.84,69.34 42.6,69.34 41.33,70.61 IC1.8 | IC9.5 31.17,137.92 v43.87,137.92 v68,137.92
  Bottom 0.406: IC2.15 56.57,35.05 55.3,36.32 55.3,47.75 56.57,49.02 IC3.15 56.57,57.91 57.84,59.18 v57.84,69.34 | IC1.8 41.33,79.5 42.6,80.77 42.6,90.93 43.87,92.2 v43.87,137.92 | IC8.5 66.73,139.19 v68,137.92 69.27,136.65 IC7.15
D4  (via drill 0.6)
  Top 0.406: v54.03,68.07 40.06,68.07 38.79,69.34 IC1.7 | IC9.6 33.71,139.19 v42.6,139.19 v69.27,139.19
  Bottom 0.406: IC2.16 54.03,35.05 52.76,36.32 52.76,47.75 54.03,49.02 IC3.16 v54.03,68.07 | IC1.7 38.79,79.5 40.06,80.77 40.06,92.2 42.6,94.74 v42.6,139.19 | IC8.6 v69.27,139.19 71.81,136.65 IC7.14
D5  (via drill 0.6)
  Top 0.406: v43.87,64.26 v51.49,64.26 | IC9.7 36.25,140.46 v45.14,140.46 v71.81,140.46
  Bottom 0.406: IC2.17 51.49,35.05 50.22,36.32 50.22,47.75 51.49,49.02 IC3.17 v51.49,64.26 | v43.87,64.26 IC1.9 43.87,79.5 45.14,80.77 v45.14,140.46 | IC8.7 v71.81,140.46 71.81,139.19 74.35,136.65 IC7.13
D6  (via drill 0.6)
  Top 0.406: IC3.18 48.95,57.91 v46.41,60.45 | IC9.8 38.79,141.73 v47.68,141.73 v74.35,141.73
  Bottom 0.406: IC2.18 48.95,35.05 47.68,36.32 47.68,47.75 48.95,49.02 IC3.18 | v46.41,60.45 IC1.10 46.41,79.5 47.68,80.77 v47.68,141.73 | IC7.12 76.89,136.65 74.35,139.19 v74.35,141.73 IC8.8
D7  (via drill 0.6)
  Top 0.406: IC3.19 46.41,57.91 45.14,59.18 45.14,61.72 46.41,62.99 v52.76,62.99 | IC9.9 41.33,143 v50.22,143 v76.89,143
  Bottom 0.406: IC2.19 46.41,35.05 45.14,36.32 45.14,47.75 46.41,49.02 IC3.19 | v52.76,62.99 52.76,69.34 54.03,70.61 IC1.13 54.03,84.58 52.76,85.85 52.76,99.82 50.22,102.36 v50.22,143 | IC8.9 v76.89,143 76.89,139.19 79.43,136.65 IC7.11
GND  (via drill 0.6)
  Top 0.406: v43.87,52.83 v57.84,52.83 | IC5.18 IC5.19 103.56,153.16 v117.53,153.16
  Top 1.27: v78.16,83.94 51.49,83.94 | 51.49,83.94 v20.65,83.94 | IC1.29 51.49,83.94
  Bottom 0.406: C4.1 52.12,82.67 51.49,83.31 IC1.29 | IC3.20 v43.87,52.83 | v57.84,52.83 57.84,45.21 56.57,43.94 IC3.14 | IC8.10 79.43,146.81 78.16,148.08 57.84,148.08 56.57,146.81 IC8.1 | v117.53,153.16 118.8,153.16 | 63.68,126.74 64.32,127.63 64.44,127.76
  Bottom 0.61: X1.5 10.67,166.19 12.63,167.64 | X2.5 224.39,162.99 223.45,162.05
  Bottom 1.016: 12.5,120.27 12.37,120.27 12.25,120.39
  Bottom 1.27: v78.16,83.94 80.06,83.31
  pour Bottom (isolate 1.016): 6,196 229,196 229,6 6,6
N$1  (via drill 0.6)
  Top 0.406: IC6.15 61.65,106.17 v46.41,106.17
  Bottom 0.406: v46.41,106.17 46.41,151.89 45.14,153.16 IC9.11
N$2  (via drill 0.6)
  Top 0.406: v101.02,162.05 v66.73,162.05
  Bottom 0.406: IC5.20 v101.02,162.05 | v66.73,162.05 IC8.16
N$3  (via drill 0.6)
  Top 0.406: IC6.14 64.19,104.9 v51.49,104.9 | IC8.11 79.43,154.43 78.16,155.7 v51.49,155.7
  Bottom 0.406: v51.49,104.9 v51.49,155.7
N$4  (via drill 0.6)
  Top 0.406: v98.48,163.32 v64.19,163.32
  Bottom 0.406: IC5.21 v98.48,163.32 | v64.19,163.32 IC8.17
N$5  (via drill 0.6)
  Top 0.406: v95.94,164.59 v61.65,164.59
  Bottom 0.406: IC5.22 v95.94,164.59 | v61.65,164.59 IC8.18
N$6  (via drill 0.6)
  Top 0.406: v93.4,165.86 v59.11,165.86
  Bottom 0.406: IC5.23 v93.4,165.86 | v59.11,165.86 IC8.19
N$8
  Top 0.406: IC6.7 74.35,104.9 65.71,104.9 65.46,105.15 65.46,111 57.84,111 57.84,128.01 59.11,129.28 IC7.19
N$9
  Bottom 0.406: R17.1 IC9.12
N$10
  Bottom 0.406: R16.1 IC9.13
N$11
  Bottom 0.406: R15.1 IC9.14
N$12
  Bottom 0.406: R14.1 IC9.15
N$13
  Bottom 0.406: IC5.6 103.56,146.81 102.29,148.08 102.29,176.02 95.27,183.04 DIS3.P$9
N$14
  Bottom 0.406: IC5.7 106.1,146.81 104.83,148.08 104.83,177.29 97.81,184.31 DIS3.P$8
N$15  (via drill 0.6)
  Top 0.406: v107.37,173.48 100.45,173.48 DIS3.P$6
  Bottom 0.406: IC5.8 108.64,146.81 107.37,148.08 v107.37,173.48
N$16  (via drill 0.6)
  Top 0.406: v109.91,188.72 138.55,188.72 DIS2.P$12
  Bottom 0.406: IC5.9 111.18,146.81 109.91,148.08 v109.91,188.72
N$17  (via drill 0.6)
  Top 0.406: v112.45,189.99 135.31,189.99 136.58,191.26 145.47,191.26 146.27,190.46 DIS2.P$9
  Bottom 0.406: IC5.10 113.72,146.81 112.45,148.08 v112.45,189.99
N$18  (via drill 0.6)
  Top 0.406: v114.99,191.26 134.04,191.26 135.31,192.53 148.01,192.53 148.81,191.73 DIS2.P$8
  Bottom 0.406: IC5.11 116.26,146.81 114.99,148.08 v114.99,191.26
N$19  (via drill 0.6)
  Top 0.406: v118.8,164.59 v150.55,164.59
  Bottom 0.406: IC5.13 v118.8,164.59 | v150.55,164.59 150.55,168.4 151.35,169.2 DIS2.P$6
N$20  (via drill 0.6)
  Top 0.406: v116.26,165.86 v186.11,165.86
  Bottom 0.406: IC5.14 v116.26,165.86 | v186.11,165.86 186.11,185.08 DIS1.P$12
N$21  (via drill 0.6)
  Top 0.406: v113.72,167.13 v183.57,167.13 | v183.57,192.53 196.27,192.53 197.27,191.53 DIS1.P$9
  Bottom 0.406: IC5.15 v113.72,167.13 | v183.57,167.13 v183.57,192.53
N$22  (via drill 0.6)
  Top 0.406: v111.18,168.4 202.62,168.4 v205.16,170.94
  Bottom 0.406: IC5.16 v111.18,168.4 | v205.16,170.94 205.16,191.26 203.89,192.53 201.35,192.53 199.81,190.99 DIS1.P$8
N$23  (via drill 0.6)
  Top 0.406: v108.64,169.67 201.35,169.67 202.35,170.67 DIS1.P$6
  Bottom 0.406: IC5.17 v108.64,169.67
N$24
  Bottom 0.406: R13.1 IC9.16
N$25
  Bottom 0.406: R12.1 IC9.17
N$26
  Bottom 0.406: R11.1 IC9.18
N$27
  Bottom 0.406: R10.1 IC9.19
N$28  (via drill 0.6)
  Top 0.406: v191.95,183.13 v141.15,183.13 v90.35,183.13 v39.04,183.13 v23.55,183.13
  Bottom 0.406: DIS1.P$11 192.19,182.86 v191.95,183.13 | v141.15,183.13 141.15,188.58 DIS2.P$11 | DIS3.P$11 90.19,182.79 v90.35,183.13 | DIS4.P$11 39.19,182.77 v39.04,183.13 | R10.2 v23.55,183.13
N$31  (via drill 0.6)
  Top 0.406: v194.49,178.56 v143.69,178.56 v92.89,178.56 v42.6,178.56
  Bottom 0.406: DIS1.P$3 194.73,178.83 v194.49,178.56 | v143.69,178.56 143.69,173.42 DIS2.P$3 | DIS3.P$3 92.73,178.4 v92.89,178.56 | v42.6,178.56 41.73,177.69 DIS4.P$3 41.84,173.27 41.84,165.35 41.33,164.84 R17.2
N$32  (via drill 0.6)  (1 unrouted)
  Top 0.406: 97.81,175.51 46.81,175.51 DIS4.P$5 | 97.81,175.51 148.81,175.51 | 148.81,175.51 199.57,175.51 199.81,175.27 DIS1.P$5 | DIS3.P$5 97.81,175.51 | DIS2.P$5 148.81,175.51 | v38.79,161.8 v46.92,161.8
  Bottom 0.406: R16.2 v38.79,161.8 | v46.92,161.8 46.92,173.38 DIS4.P$5
  other vias: 148.77,173.42
N$33  (via drill 0.6)
  Top 0.406: v194.49,184.66 v143.69,184.66 v92.38,184.66 v41.58,184.66
  Bottom 0.406: DIS1.P$10 194.73,184.39 v194.49,184.66 | v92.38,184.66 92.38,188.27 DIS3.P$10 | DIS2.P$10 143.73,184.19 v143.69,184.66 | DIS4.P$10 41.73,184.29 v41.58,184.66 41.97,184.28 41.97,180.34 40.57,178.94 40.57,166.37 36.25,162.05 R15.2
N$34  (via drill 0.6)
  Top 0.406: v187.89,180.08 v138.61,180.08 v88.32,180.08 v37.01,180.08
  Bottom 0.406: DIS1.P$1 189.65,178.32 v187.89,180.08 | v138.61,180.08 138.61,173.42 DIS2.P$1 | DIS3.P$1 87.65,179.41 v88.32,180.08 | DIS4.P$1 36.65,179.72 v37.01,180.08 | 36.63,173.36 DIS4.P$1 | R14.2 33.71,170.44 DIS4.P$1
N$36  (via drill 0.6)
  Top 0.406: 100.35,186.18 49.2,186.18 49.08,186.31 | 151.35,186.18 201.35,186.18 202.35,187.18 DIS1.P$7 | 151.35,186.18 100.35,186.18 | v25.45,186.31 49.08,186.31 | DIS3.P$7 100.35,186.18 | DIS2.P$7 151.35,186.18 | DIS4.P$7 49.35,186.31 49.08,186.31
  Bottom 0.406: 25.38,186.23 v25.45,186.31 | 26.09,185.67 v25.45,186.31 | R11.2 26.09,186.31 v25.45,186.31
N$37  (via drill 0.6)
  Top 0.406: v197.03,177.04 v146.23,177.04 v95.43,177.04 44.27,177.04 | v27.99,177.04 44.27,177.04 | DIS4.P$4 44.27,177.04
  Bottom 0.406: DIS1.P$4 197.27,177.31 v197.03,177.04 | v146.23,177.04 146.23,173.42 DIS2.P$4 | DIS3.P$4 95.27,176.87 v95.43,177.04 | 27.92,176.96 v27.99,177.04 28.57,176.46 28.63,176.4 R12.2
N$38  (via drill 0.6)
  Top 0.406: v190.43,181.61 v142.68,181.61 v91.88,181.61 v40.57,181.61 40.44,181.74 | v38.79,167.13 v31.17,167.13
  Bottom 0.406: DIS1.P$2 192.19,179.34 v190.43,181.61 | v142.68,181.61 141.15,180.08 141.15,173.42 DIS2.P$2 | DIS3.P$2 90.19,179.92 v91.88,181.61 | v40.57,181.61 39.19,180.23 DIS4.P$2 39.19,167.53 v38.79,167.13 | R13.2 v31.17,167.13
R0
  Top 0.406: U$1.SW2 U$9.SW2 U$17.SW2 U$25.SW2 125.15,21.08 125.15,112.52 59.11,112.52 IC7.2
  Bottom 0.406: R2.2 U$1.SW2
R1
  Top 0.406: U$2.SW2 U$10.SW2 U$18.SW2 U$26.SW2 126.42,40.08 126.42,113.79 61.65,113.79 IC7.3
  Bottom 0.406: R3.2 216.59,40.13 U$2.SW2
R2
  Top 0.406: U$3.SW2 U$11.SW2 U$19.SW2 U$27.SW2 127.69,59.08 127.69,115.06 64.19,115.06 IC7.4
  Bottom 0.406: R4.2 216.64,59.18 U$3.SW2
R3
  Top 0.406: U$4.SW2 U$12.SW2 U$20.SW2 U$28.SW2 128.96,78.08 128.96,116.33 66.73,116.33 IC7.5
  Bottom 0.406: R5.2 216.69,78.23 U$4.SW2
R4
  Top 0.406: U$5.SW2 U$13.SW2 U$21.SW2 U$29.SW2 U$33.SW2 130.23,97.08 130.23,117.6 69.27,117.6 IC7.6
  Bottom 0.406: R6.2 216.54,101.09 U$5.SW2
R5
  Top 0.406: U$14.SW2 U$22.SW2 U$30.SW2 U$34.SW2 137.75,118.87 71.81,118.87 IC7.7 | U$14.SW2 197.67,116.08 197.67,115.57 197.54,115.57 U$14.SW2 | U$14.SW2 U$6.SW2
  Bottom 0.406: R7.2 216.79,116.33 U$6.SW2
R6  (via drill 0.6)  (1 unrouted)
  Top 0.406: U$7.SW2 U$15.SW2 178.03,135.08 177.73,135.38 159.84,135.38 U$31.SW2 v146.74,135.08 U$35.SW2 | v146.74,120.14 74.35,120.14 IC7.8
  Bottom 0.406: v146.74,120.14 v146.74,135.08 | R8.2 216.84,135.38 U$7.SW2
R7  (via drill 0.6)
  Top 0.406: U$8.SW2 U$16.SW2 U$24.SW2 U$32.SW2 U$36.SW2 140.54,154.43 v127.18,154.43 | v127.18,121.41 76.89,121.41 IC7.9
  Bottom 0.406: v127.18,121.41 v127.18,154.43 | R9.2 216.89,154.43 U$8.SW2

### Text on the board
bPlace: C:/Users/aleksander.grodzki/Downloads/jabluszko.bmp
tNames: 74HCT574N | 74HCT574N | 74HCT154N | 74HCT541N | 74HCT138N | Z80 | 6264 | 74HCT32N | AT28C64 | HP35 clone / (c)AG / 2022-04
201bmp: C:/Users/aleksander.grodzki/Desktop/35bk.bmp